# EasyEDA schematic SCH_CableUndefinedMini Rev2_2024-05-01.json
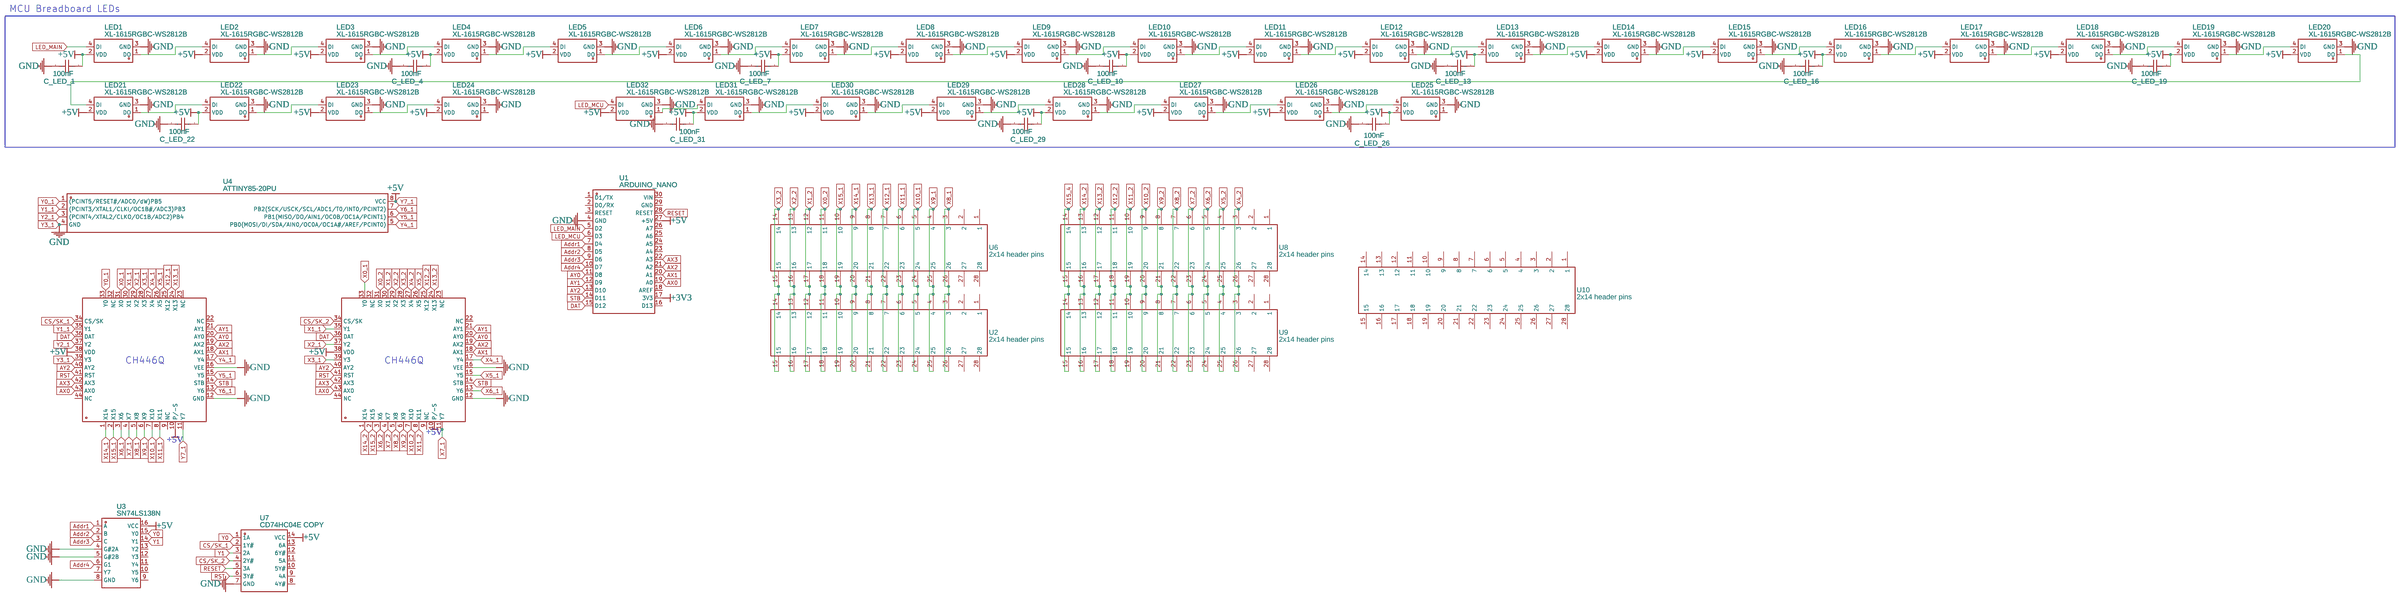
[diagram p0: schematic sheet]

## Parts
C_LED_1  100nF  [C0402]
C_LED_4  100nF  [C0402]
C_LED_7  100nF  [C0402]
C_LED_10  100nF  [C0402]
C_LED_13  100nF  [C0402]
C_LED_16  100nF  [C0402]
C_LED_19  100nF  [C0402]
C_LED_22  100nF  [C0402]
C_LED_26  100nF  [C0402]
C_LED_29  100nF  [C0402]
C_LED_31  100nF  [C0402]
LED1  XL-1615RGBC-WS2812B  [LED-SMD_4P-L1.6-W1.5_XL-1615RGBC-WS2812B]
LED2  XL-1615RGBC-WS2812B  [LED-SMD_4P-L1.6-W1.5_XL-1615RGBC-WS2812B]
LED3  XL-1615RGBC-WS2812B  [LED-SMD_4P-L1.6-W1.5_XL-1615RGBC-WS2812B]
LED4  XL-1615RGBC-WS2812B  [LED-SMD_4P-L1.6-W1.5_XL-1615RGBC-WS2812B]
LED5  XL-1615RGBC-WS2812B  [LED-SMD_4P-L1.6-W1.5_XL-1615RGBC-WS2812B]
LED6  XL-1615RGBC-WS2812B  [LED-SMD_4P-L1.6-W1.5_XL-1615RGBC-WS2812B]
LED7  XL-1615RGBC-WS2812B  [LED-SMD_4P-L1.6-W1.5_XL-1615RGBC-WS2812B]
LED8  XL-1615RGBC-WS2812B  [LED-SMD_4P-L1.6-W1.5_XL-1615RGBC-WS2812B]
LED9  XL-1615RGBC-WS2812B  [LED-SMD_4P-L1.6-W1.5_XL-1615RGBC-WS2812B]
LED10  XL-1615RGBC-WS2812B  [LED-SMD_4P-L1.6-W1.5_XL-1615RGBC-WS2812B]
LED11  XL-1615RGBC-WS2812B  [LED-SMD_4P-L1.6-W1.5_XL-1615RGBC-WS2812B]
LED12  XL-1615RGBC-WS2812B  [LED-SMD_4P-L1.6-W1.5_XL-1615RGBC-WS2812B]
LED13  XL-1615RGBC-WS2812B  [LED-SMD_4P-L1.6-W1.5_XL-1615RGBC-WS2812B]
LED14  XL-1615RGBC-WS2812B  [LED-SMD_4P-L1.6-W1.5_XL-1615RGBC-WS2812B]
LED15  XL-1615RGBC-WS2812B  [LED-SMD_4P-L1.6-W1.5_XL-1615RGBC-WS2812B]
LED16  XL-1615RGBC-WS2812B  [LED-SMD_4P-L1.6-W1.5_XL-1615RGBC-WS2812B]
LED17  XL-1615RGBC-WS2812B  [LED-SMD_4P-L1.6-W1.5_XL-1615RGBC-WS2812B]
LED18  XL-1615RGBC-WS2812B  [LED-SMD_4P-L1.6-W1.5_XL-1615RGBC-WS2812B]
LED19  XL-1615RGBC-WS2812B  [LED-SMD_4P-L1.6-W1.5_XL-1615RGBC-WS2812B]
LED20  XL-1615RGBC-WS2812B  [LED-SMD_4P-L1.6-W1.5_XL-1615RGBC-WS2812B]
LED21  XL-1615RGBC-WS2812B  [LED-SMD_4P-L1.6-W1.5_XL-1615RGBC-WS2812B]
LED22  XL-1615RGBC-WS2812B  [LED-SMD_4P-L1.6-W1.5_XL-1615RGBC-WS2812B]
LED23  XL-1615RGBC-WS2812B  [LED-SMD_4P-L1.6-W1.5_XL-1615RGBC-WS2812B]
LED24  XL-1615RGBC-WS2812B  [LED-SMD_4P-L1.6-W1.5_XL-1615RGBC-WS2812B]
LED25  XL-1615RGBC-WS2812B  [LED-SMD_4P-L1.6-W1.5_XL-1615RGBC-WS2812B]
LED26  XL-1615RGBC-WS2812B  [LED-SMD_4P-L1.6-W1.5_XL-1615RGBC-WS2812B]
LED27  XL-1615RGBC-WS2812B  [LED-SMD_4P-L1.6-W1.5_XL-1615RGBC-WS2812B]
LED28  XL-1615RGBC-WS2812B  [LED-SMD_4P-L1.6-W1.5_XL-1615RGBC-WS2812B]
LED29  XL-1615RGBC-WS2812B  [LED-SMD_4P-L1.6-W1.5_XL-1615RGBC-WS2812B]
LED30  XL-1615RGBC-WS2812B  [LED-SMD_4P-L1.6-W1.5_XL-1615RGBC-WS2812B]
LED31  XL-1615RGBC-WS2812B  [LED-SMD_4P-L1.6-W1.5_XL-1615RGBC-WS2812B]
LED32  XL-1615RGBC-WS2812B  [LED-SMD_4P-L1.6-W1.5_XL-1615RGBC-WS2812B]
M1  CH446Q  [LQFP-44_L10.0-W10.0-P0.80-LS12.0-BL]
M2  CH446Q  [LQFP-44_L10.0-W10.0-P0.80-LS12.0-BL]
U1  ARDUINO_NANO  [COMM-TH_ARDUINO_NANO]
U2  2x14 header pins  [2X14 HEADER PINS]
U3  SN74LS138N  [DIP-16_L19.8-W6.5-P2.54-LS7.6-BL]
U4  ATTINY85-20PU  [PDIP-8_L9.3-W6.4-P2.54-LS7.9-BL-1]
U6  2x14 header pins  [2X14 HEADER PINS]
U7  CD74HC04E COPY  [PDIP-14_L19.7-W6.6-P2.54-LS8.3-BL]
U8  2x14 header pins  [2X14 HEADER PINS]
U9  2x14 header pins  [2X14 HEADER PINS]
U10  2x14 header pins  [2X14 HEADER PINS]

## Library data of the parts
C_LED_1 C_LED_4 C_LED_7 C_LED_10 C_LED_13 C_LED_16 C_LED_19 C_LED_22 C_LED_26 C_LED_29 C_LED_31 = AC0402KRX7R9BB104: Contributor: LCSC; Supplier: LCSC; Supplier Part: C2888326; Manufacturer: YAGEO(国巨); JLCPCB Part Class: Extended Part
LED1-LED32 = XL-1615RGBC-WS2812B: Contributor: lcsc; Supplier: LCSC; Supplier Part: C5349954; Manufacturer: XINGLIGHT(成兴光); JLCPCB Part Class: Extended Part
M1 M2 = CH446Q: Manufacturer: WCH(南京沁恒); Supplier: LCSC; Supplier Part: C109471; JLCPCB Part Class: Extended Part
U1 = ARDUINO_NANO: Contributor: lcsc; Supplier: LCSC; Supplier Part: C9900017879; Manufacturer: null; JLCPCB Part Class: Extended Part; link: https://lcsc.com/eda_search?q=C9900017879&%26type=1&ref=editor
U2 U6 U8-U10 = 2x14 header pins: Contributor: matthew_tom
U3 = SN74LS138N: Contributor: LCSC; Supplier: LCSC; Supplier Part: C352964; Manufacturer: TI(德州仪器); JLCPCB Part Class: Extended Part; link: https://lcsc.com/eda_search?q=C352964&%26type=1&ref=editor
U4 = ATTINY85-20PU: Contributor: LCSC; Supplier: LCSC; Supplier Part: C965497; Manufacturer: MICROCHIP(美国微芯); JLCPCB Part Class: Extended Part
U7 = CD74HC04E COPY: Supplier: LCSC; Supplier Part: C90839; Manufacturer: Texas Instruments; Manufacturer Part: CD74HC04E; Contributor: LCSC; JLCPCB Part Class: Extended Part

## Nets
+3V3: U1.17(3V3)
+5V: C_LED_1.1 C_LED_4.1 C_LED_7.1 C_LED_10.1 C_LED_13.1 C_LED_16.1 C_LED_19.1 C_LED_22.1 C_LED_26.1 C_LED_29.1 C_LED_31.1 LED1.2(VDD) LED2.2(VDD) LED3.2(VDD) LED4.2(VDD) LED5.2(VDD) LED6.2(VDD) LED7.2(VDD) LED8.2(VDD) LED9.2(VDD) LED10.2(VDD) LED11.2(VDD) LED12.2(VDD) LED13.2(VDD) LED14.2(VDD) LED15.2(VDD) LED16.2(VDD) LED17.2(VDD) LED18.2(VDD) LED19.2(VDD) LED20.2(VDD) LED21.2(VDD) LED22.2(VDD) LED23.2(VDD) LED24.2(VDD) LED25.2(VDD) LED26.2(VDD) LED27.2(VDD) LED28.2(VDD) LED29.2(VDD) LED30.2(VDD) LED31.2(VDD) LED32.2(VDD) M1.10(P/-S) M1.11(Y7) M1.38(VDD) M2.10(P/-S) M2.38(VDD) U1.27(+5V) U3.16(VCC) U4.8(VCC) U7.14(VCC)
GND: C_LED_1.2 C_LED_4.2 C_LED_7.2 C_LED_10.2 C_LED_13.2 C_LED_16.2 C_LED_19.2 C_LED_22.2 C_LED_26.2 C_LED_29.2 C_LED_31.2 LED1.3(GND) LED2.3(GND) LED3.3(GND) LED4.3(GND) LED5.3(GND) LED6.3(GND) LED7.3(GND) LED8.3(GND) LED9.3(GND) LED10.3(GND) LED11.3(GND) LED12.3(GND) LED13.3(GND) LED14.3(GND) LED15.3(GND) LED16.3(GND) LED17.3(GND) LED18.3(GND) LED19.3(GND) LED20.3(GND) LED21.3(GND) LED22.3(GND) LED23.3(GND) LED24.3(GND) LED25.3(GND) LED26.3(GND) LED27.3(GND) LED28.3(GND) LED29.3(GND) LED30.3(GND) LED31.3(GND) LED32.3(GND) M1.12(GND) M1.16(VEE) M1.39(Y3) M2.12(GND) M2.16(VEE) U1.4(GND) U3.4(G#2A) U3.5(G#2B) U3.8(GND) U4.4(GND) U7.7(GND)
Addr1: U1.7(D4) U3.1(A)
Addr2: U1.8(D5) U3.2(B)
Addr3: U1.9(D6) U3.3(C)
Addr4: U1.10(D7) U3.6(G1)
AX0: M1.43(AX0) M2.43(AX0) U1.19(A0)
AX1: M1.18(AX1) M2.18(AX1) U1.20(A1)
AX2: M1.19(AX2) M2.19(AX2) U1.21(A2)
AX3: M1.42(AX3) M2.42(AX3) U1.22(A3)
AY0: M1.20(AY0) M2.20(AY0) U1.11(D8)
AY1: M1.21(AY1) M2.21(AY1) U1.12(D9)
AY2: M1.40(AY2) M2.40(AY2) U1.13(D10)
CS/SK_1: M1.34(CS/SK) U7.2(1Y#)
CS/SK_2: M2.34(CS/SK) U7.4(2Y#)
DAT: M1.36(DAT) M2.36(DAT) U1.15(D12)
LED_MAIN: LED1.4(DI) U1.5(D2)
LED_MCU: LED32.4(DI) U1.6(D3)
RESET: U1.28(RESET) U7.5(3A)
RST: M1.41(RST) M2.41(RST) U7.6(3Y#)
STB: M1.14(STB) M2.14(STB) U1.14(D11)
X0_1: M1.31(X0) M2.33(Y0)
X0_2: M2.31(X0) U2.11 U2.18 U6.11 U6.18
X1_1: M1.30(X1) M2.35(Y1)
X1_2: M2.30(X1) U2.12 U2.17 U6.12 U6.17
X2_1: M1.29(X2) M2.37(Y2)
X2_2: M2.29(X2) U2.13 U2.16 U6.13 U6.16
X3_1: M1.28(X3) M2.39(Y3)
X3_2: M2.28(X3) U2.14 U2.15 U6.14 U6.15
X4_1: M1.27(X4) M2.17(Y4)
X4_2: M2.27(X4) U8.3 U8.26 U9.3 U9.26
X5_1: M1.26(X5) M2.15(Y5)
X5_2: M2.26(X5) U8.4 U8.25 U9.4 U9.25
X6_1: M1.3(X6) M2.13(Y6)
X6_2: M2.3(X6) U8.5 U8.24 U9.5 U9.24
X7_1: M1.4(X7) M2.11(Y7)
X7_2: M2.4(X7) U8.6 U8.23 U9.6 U9.23
X8_1: M1.5(X8) U2.3 U2.26 U6.3 U6.26
X8_2: M2.5(X8) U8.7 U8.22 U9.7 U9.22
X9_1: M1.6(X9) U2.4 U2.25 U6.4 U6.25
X9_2: M2.6(X9) U8.8 U8.21 U9.8 U9.21
X10_1: M1.7(X10) U2.5 U2.24 U6.5 U6.24
X10_2: M2.7(X10) U8.9 U8.20 U9.9 U9.20
X11_1: M1.8(X11) U2.6 U2.23 U6.6 U6.23
X11_2: M2.8(X11) U8.10 U8.19 U9.10 U9.19
X12_1: M1.25(X12) U2.7 U2.22 U6.7 U6.22
X12_2: M2.25(X12) U8.11 U8.18 U9.11 U9.18
X13_1: M1.24(X13) U2.8 U2.21 U6.8 U6.21
X13_2: M2.24(X13) U8.12 U8.17 U9.12 U9.17
X14_1: M1.1(X14) U2.9 U2.20 U6.9 U6.20
X14_2: M2.1(X14) U8.13 U8.16 U9.13 U9.16
X15_1: M1.2(X15) U2.10 U2.19 U6.10 U6.19
X15_2: M2.2(X15)
X15_4: U8.14 U8.15 U9.14 U9.15
Y0: U3.15(Y0) U7.1(1A)
Y0_1: M1.33(Y0) U4.1((PCINT5/RESET#/ADC0/dW)PB5)
Y1: U3.14(Y1) U7.3(2A)
Y1_1: M1.35(Y1) U4.2((PCINT3/XTAL1/CLKI/OC1B#/ADC3)PB3)
Y2_1: M1.37(Y2) U4.3((PCINT4/XTAL2/CLKO/OC1B/ADC2)PB4)
Y4_1: M1.17(Y4) U4.5(PB0(MOSI/DI/SDA/AIN0/OC0A/OC1A#/AREF/PCINT0))
Y5_1: M1.15(Y5) U4.6(PB1(MISO/DO/AIN1/OC0B/OC1A/PCINT1))
Y6_1: M1.13(Y6) U4.7(PB2(SCK/USCK/SCL/ADC1/T0/INT0/PCINT2))
Net-(LED1-1): LED1.1(DO) LED2.4(DI)
Net-(LED2-1): LED2.1(DO) LED3.4(DI)
Net-(LED3-1): LED3.1(DO) LED4.4(DI)
Net-(LED4-1): LED4.1(DO) LED5.4(DI)
Net-(LED5-1): LED5.1(DO) LED6.4(DI)
Net-(LED6-1): LED6.1(DO) LED7.4(DI)
Net-(LED7-1): LED7.1(DO) LED8.4(DI)
Net-(LED8-1): LED8.1(DO) LED9.4(DI)
Net-(LED9-1): LED9.1(DO) LED10.4(DI)
Net-(LED10-1): LED10.1(DO) LED11.4(DI)
Net-(LED11-1): LED11.1(DO) LED12.4(DI)
Net-(LED12-1): LED12.1(DO) LED13.4(DI)
Net-(LED13-1): LED13.1(DO) LED14.4(DI)
Net-(LED14-1): LED14.1(DO) LED15.4(DI)
Net-(LED15-1): LED15.1(DO) LED16.4(DI)
Net-(LED16-1): LED16.1(DO) LED17.4(DI)
Net-(LED17-1): LED17.1(DO) LED18.4(DI)
Net-(LED18-1): LED18.1(DO) LED19.4(DI)
Net-(LED19-1): LED19.1(DO) LED20.4(DI)
Net-(LED20-1): LED20.1(DO) LED21.4(DI)
Net-(LED21-1): LED21.1(DO) LED22.4(DI)
Net-(LED22-1): LED22.1(DO) LED23.4(DI)
Net-(LED23-1): LED23.1(DO) LED24.4(DI)
Net-(LED25-4): LED25.4(DI) LED26.1(DO)
Net-(LED26-4): LED26.4(DI) LED27.1(DO)
Net-(LED27-4): LED27.4(DI) LED28.1(DO)
Net-(LED28-4): LED28.4(DI) LED29.1(DO)
Net-(LED29-4): LED29.4(DI) LED30.1(DO)
Net-(LED30-4): LED30.4(DI) LED31.1(DO)
Net-(LED31-4): LED31.4(DI) LED32.1(DO)

Not connected (* = marked no-connect by the designer): LED24 1(DO); LED25 1(DO); M1 9(NC) 22(NC) 23(NC) 32(NC) 44(NC); M2 9(NC) 22(NC) 23(NC) 32(NC) 44(NC); U1 1(D1/TX) 2(D0/RX) 3(RESET) 16(D13) 18(AREF) 23(A4) 24(A5) 25(A6) 26(A7) 29(GND) 30(VIN); U2 1 2 27 28; U3 7(Y7) 9(Y6) 10(Y5) 11(Y4) 12(Y3) 13(Y2); U6 1 2 27 28; U7 8(4Y#) 9(4A) 10(5Y#) 11(5A) 12(6Y#) 13(6A); U8 1 2 27 28; U9 1 2 27 28; U10 1 2 3 4 5 6 7 8 9 10 11 12 13 14 15 16 17 18 19 20 21 22 23 24 25 26 27 28

## Notes on the sheet
- MCU Breadboard LEDs
- CH446Q
- CH446Q
